# Altium schematic sheet 4.Power_switching.SchDoc
size A4; SheetNumber: 5; SheetTotal: 13
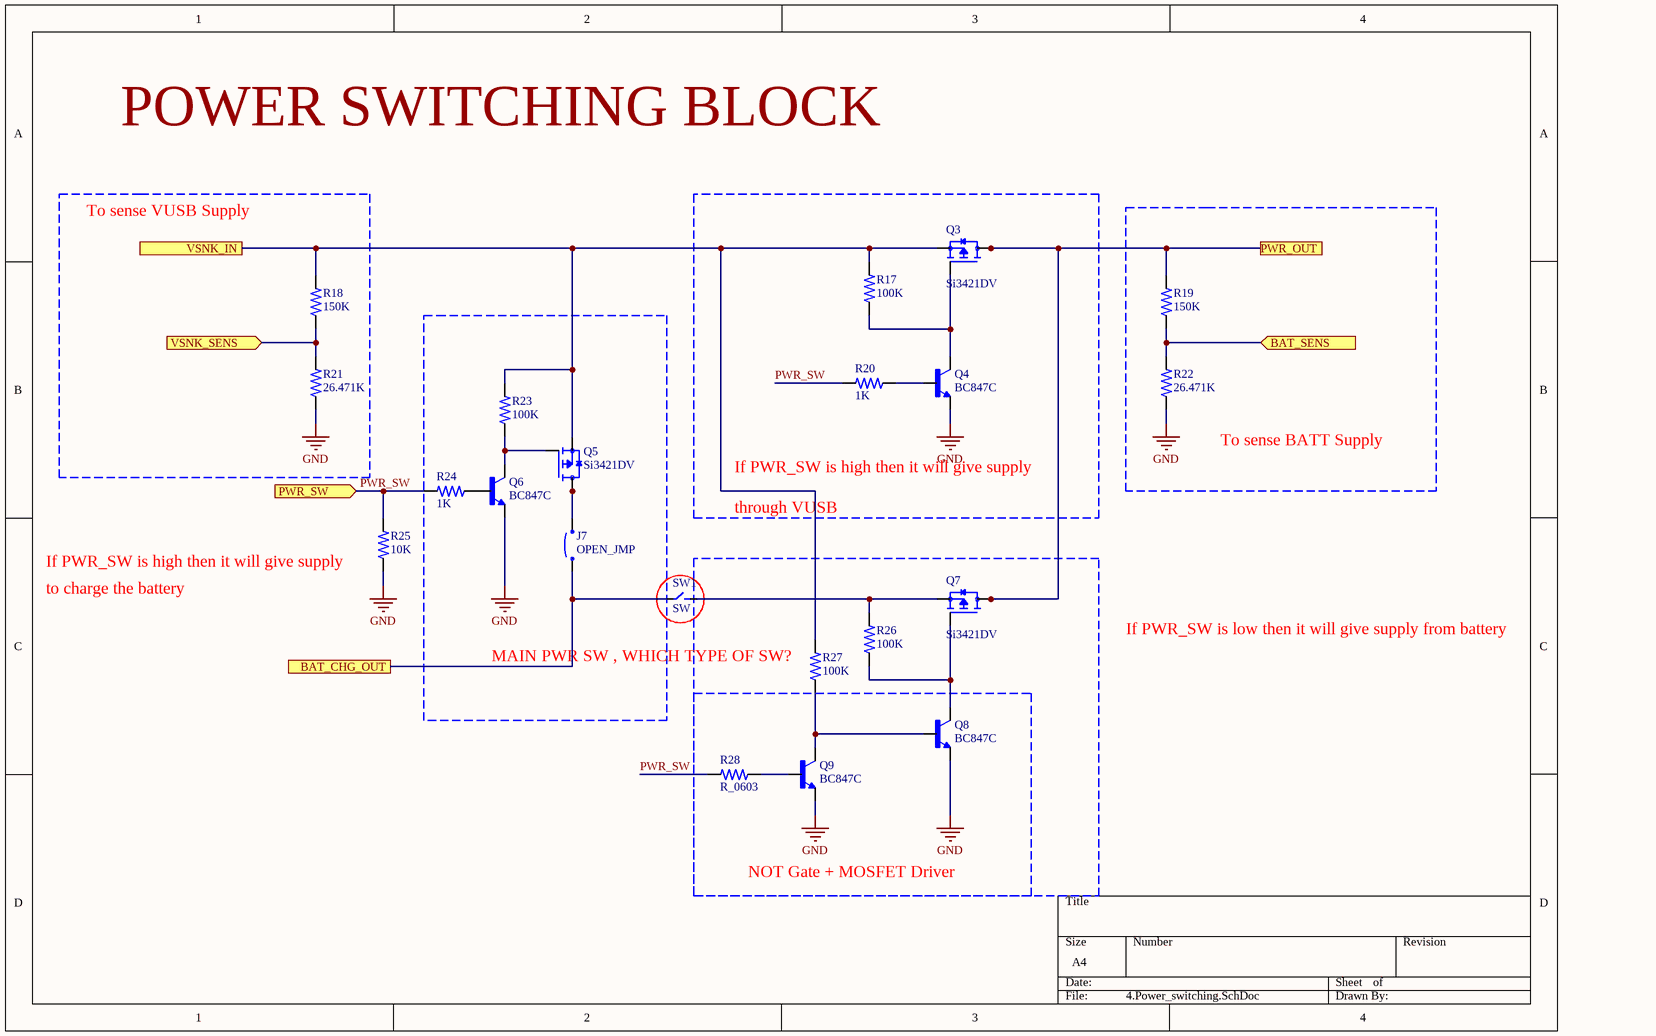
[diagram p0: 4.Power_switching.SchDoc]

## Parts
J7  OPEN_JMP  [OPEN_JMP]
Q3  Si3421DV  [TSOP-6]
Q4  BC847C  [SOT-23-3]
Q5  Si3421DV  [TSOP-6]
Q6  BC847C  [SOT-23-3]
Q7  Si3421DV  [TSOP-6]
Q8  BC847C  [SOT-23-3]
Q9  BC847C  [SOT-23-3]
R17  100K  [R_0603]
R18  150K  [R_0603]
R19  150K  [R_0603]
R20  1K  [R_0603]
R21  26.471K  [R_0603]
R22  26.471K  [R_0603]
R23  100K  [R_0603]
R24  1K  [R_0603]
R25  10K  [R_0603]
R26  100K  [R_0603]
R27  100K  [R_0603]
R28  R_0603  [R_0603]
SW1  SW

## Blocks framed on the sheet
To sense VUSB Supply: R18 R21
To sense BATT Supply: R19 R22
MAIN PWR SW , WHICH TYPE OF SW?: J7 Q5 Q6 R23 R24
NOT Gate + MOSFET Driver: Q8 Q9 R28

## Ports
BAT_CHG_OUT, BAT_SENS (in), PWR_OUT, PWR_SW (in), VSNK_IN, VSNK_SENS (in)

## Nets
GND: Q4.2(E) Q6.2(E) Q8.2(E) Q9.2(E) R21.1 R22.1 R25.1
BAT_CHG_OUT: J7.1 SW1.1 ; port BAT_CHG_OUT
BAT_SENS: R19.1 R22.2 ; port BAT_SENS
PWR_OUT: Q3.1(D) Q3.2(D) Q3.5(D) Q3.6(D) Q7.1(D) Q7.2(D) Q7.5(D) Q7.6(D) R19.2 ; port PWR_OUT
PWR_SW: R20.2 R24.2 R25.2 R28.2 ; port PWR_SW
VSNK_IN: Q3.4(S) Q5.4(S) R17.2 R18.2 R23.2 R27.2 ; port VSNK_IN
VSNK_SENS: R18.1 R21.2 ; port VSNK_SENS
NetJ7_2: J7.2 Q5.1(D) Q5.2(D) Q5.5(D) Q5.6(D)
NetQ3_3: Q3.3(G) Q4.3(C) R17.1
NetQ4_1: Q4.1(B) R20.1
NetQ5_3: Q5.3(G) Q6.3(C) R23.1
NetQ6_1: Q6.1(B) R24.1
NetQ7_3: Q7.3(G) Q8.3(C) R26.1
NetQ7_4: Q7.4(S) R26.2 SW1.2
NetQ8_1: Q8.1(B) Q9.3(C) R27.1
NetQ9_1: Q9.1(B) R28.1

## Notes on the sheet
- POWER SWITCHING BLOCK
- If PWR_SW is high then it will give supply
- through VUSB
- (near R25) If PWR_SW is high then it will give supply
- to charge the battery
- If PWR_SW is low then it will give supply from battery

## Library data of the parts
Q3 Q5 Q7 = Si3421DV: MFR: Vishay Siliconix; D: P-Channel 30 V (D-S) MOSFET; PN: SI3421DV-T1-GE3; P: TSOP-6; URL: https://www.mouser.in/ProductDetail/Vishay-Semiconductors/SI3421DV-T1-GE3?qs=dpt6vIvaxwjvmZPXyyVpRg%3D%3D
Q4 Q6 Q8 Q9 = BC847C: MFR: Nexperia; D: Bipolar Transistors - BJT BC847C/SOT23/TO-236AB; PN: BC847C,215; P: SOT-23-3; URL: https://www.mouser.in/ProductDetail/Nexperia/BC847C215?qs=me8TqzrmIYVnv3C18%2Fxa3Q%3D%3D
R17-R27 = R_0603: D: *; MFR: *; P: *; PN: *; URL: *
R28 = R_0603: D: *; MFR: *; P: *; PN: *; URL: *